# EAGLE design TT7-F v1.4 (EAGLE 7.4.0)
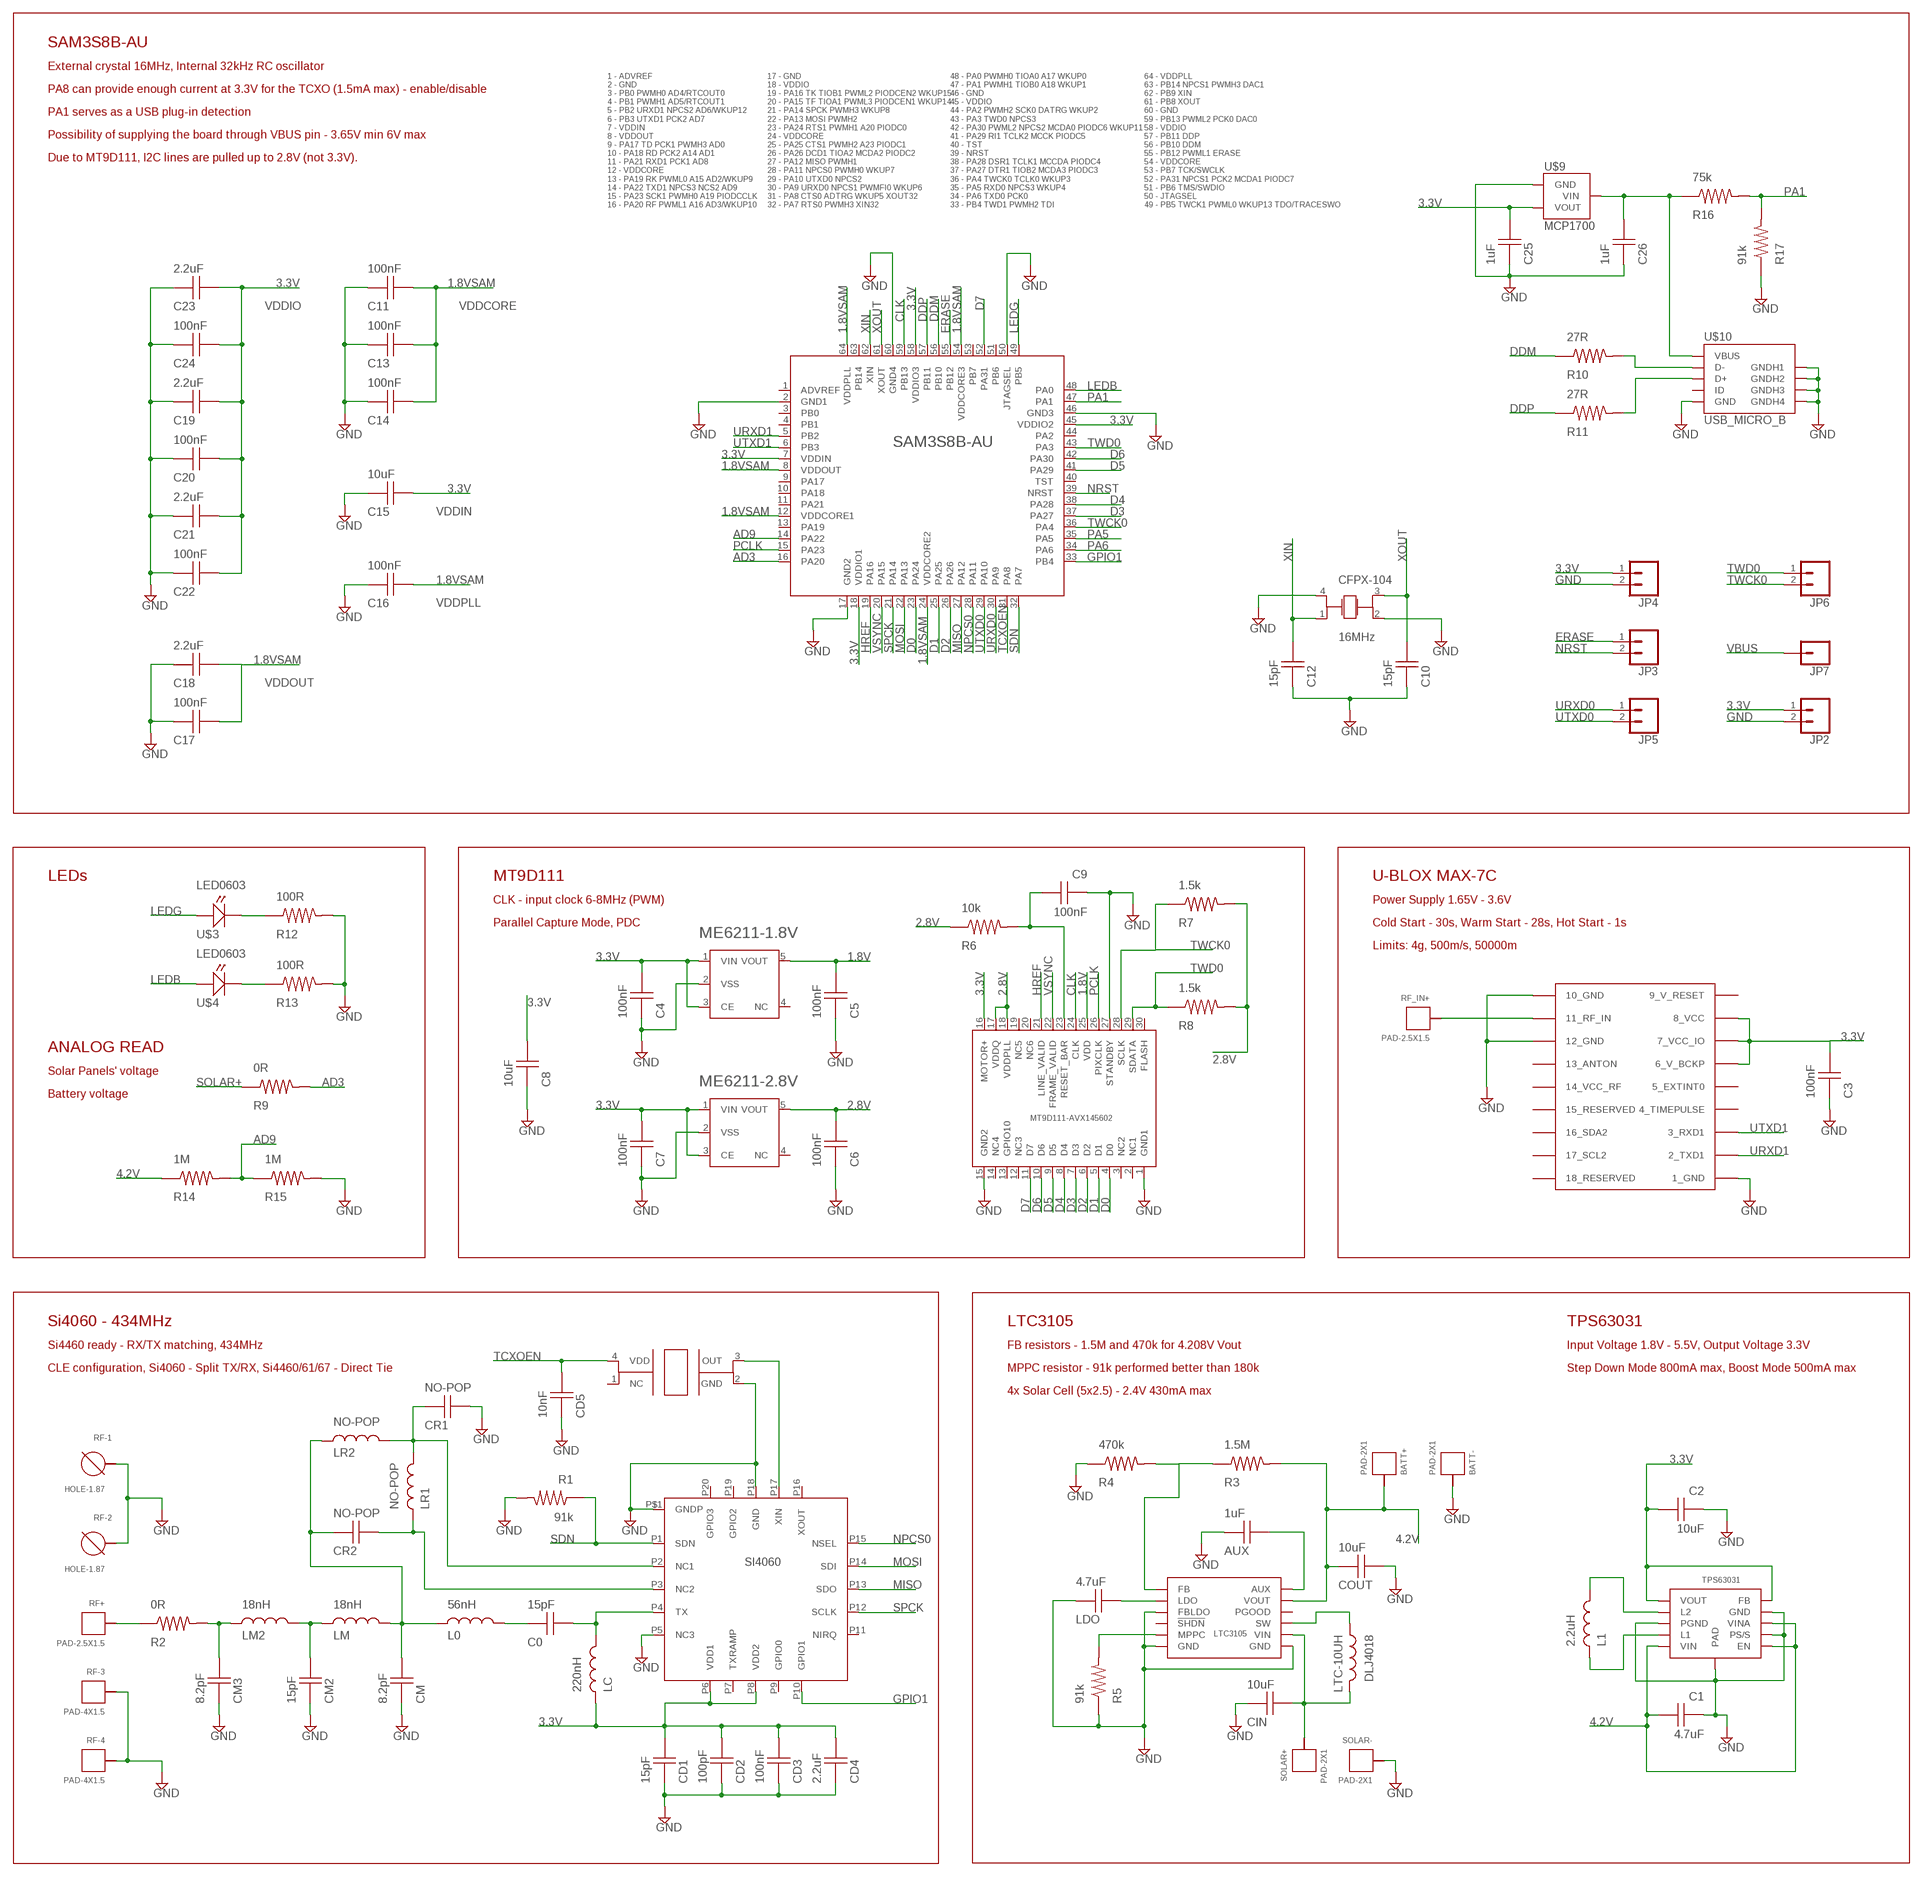
[diagram p0: schematic, sheet 1]

## Parts
AUX  1uF  CAP0603  [CAP0603]
BATT+  PAD-2X1  [PAD-2X1]
BATT-  PAD-2X1  [PAD-2X1]
C0  15pF  CAP0402  [CAP0402]
C1  4.7uF  CAP0603  [CAP0603]
C2  10uF  CAP0805  [CAP0805]
C3  100nF  CAP0402  [CAP0402]
C4  100nF  CAP0402  [CAP0402]
C5  100nF  CAP0402  [CAP0402]
C6  100nF  CAP0402  [CAP0402]
C7  100nF  CAP0402  [CAP0402]
C8  10uF  CAP0805  [CAP0805]
C9  100nF  CAP0402  [CAP0402]
C10  15pF  CAP0402  [CAP0402]
C11  100nF  CAP0402  [CAP0402]
C12  15pF  CAP0402  [CAP0402]
C13  100nF  CAP0402  [CAP0402]
C14  100nF  CAP0402  [CAP0402]
C15  10uF  CAP0603  [CAP0603]
C16  100nF  CAP0402  [CAP0402]
C17  100nF  CAP0402  [CAP0402]
C18  2.2uF  CAP0402  [CAP0402]
C19  2.2uF  CAP0402  [CAP0402]
C20  100nF  CAP0402  [CAP0402]
C21  2.2uF  CAP0402  [CAP0402]
C22  100nF  CAP0402  [CAP0402]
C23  2.2uF  CAP0402  [CAP0402]
C24  100nF  CAP0402  [CAP0402]
C25  1uF  CAP0603  [CAP0603]
C26  1uF  CAP0603  [CAP0603]
CD1  15pF  CAP0402  [CAP0402]
CD2  100pF  CAP0402  [CAP0402]
CD3  100nF  CAP0402  [CAP0402]
CD4  2.2uF  CAP0402  [CAP0402]
CD5  10nF  CAP0402  [CAP0402]
CFPX-104  16MHz  CFPX-104  [CFPX-104]
CIN  10uF  CAP0805  [CAP0805]
CM  8.2pF  CAP0402  [CAP0402]
CM2  15pF  CAP0402  [CAP0402]
CM3  8.2pF  CAP0402  [CAP0402]
COUT  10uF  CAP0805  [CAP0805]
CR1  NO-POP  CAP0402  [CAP0402]
CR2  NO-POP  CAP0402  [CAP0402]
JP2  M021X02_NO_SILK  [1X02_NO_SILK]
JP3  M021X02_NO_SILK  [1X02_NO_SILK]
JP4  M021X02_NO_SILK  [1X02_NO_SILK]
JP5  M021X02_NO_SILK  [1X02_NO_SILK]
JP6  M021X02_NO_SILK  [1X02_NO_SILK]
JP7  M01PTH_NO_SILK_YES_STOP  [1X01_NO_SILK]
L0  56nH  IND0402  [IND0402]
L1  2.2uH  DLJ3015  [DLJ3015]
LC  220nH  IND0402  [IND0402]
LDO  4.7uF  CAP0603  [CAP0603]
LM  18nH  IND0402  [IND0402]
LM2  18nH  IND0402  [IND0402]
LR1  NO-POP  IND0402  [IND0402]
LR2  NO-POP  IND0402  [IND0402]
LTC-10UH  DLJ4018  [DLJ4018]
ME6211-1.8V  ME6211  [ME6211]
ME6211-2.8V  ME6211  [ME6211]
R1  91k  RES0402  [RES0402]
R2  0R  RES0402  [RES0402]
R3  1.5M  RES0402  [RES0402]
R4  470k  RES0402  [RES0402]
R5  91k  RES0402  [RES0402]
R6  10k  RES0402  [RES0402]
R7  1.5k  RES0402  [RES0402]
R8  1.5k  RES0402  [RES0402]
R9  0R  RES0402  [RES0402]
R10  27R  RES0402  [RES0402]
R11  27R  RES0402  [RES0402]
R12  100R  RES0402  [RES0402]
R13  100R  RES0402  [RES0402]
R14  1M  RES0603  [RES0603]
R15  1M  RES0603  [RES0603]
R16  75k  RES0402  [RES0402]
R17  91k  RES0402  [RES0402]
RF+  PAD-2.5X1.5  [PAD-2.5X1.5]
RF-1  HOLE-1.87  [HOLE-1.87]
RF-2  HOLE-1.87  [HOLE-1.87]
RF-3  PAD-4X1.5  [PAD-4X1.5]
RF-4  PAD-4X1.5  [PAD-4X1.5]
RF_IN+  PAD-2.5X1.5  [PAD-2.5X1.5]
SOLAR+  PAD-2X1  [PAD-2X1]
SOLAR-  PAD-2X1  [PAD-2X1]
TCXO  32MHz  I547-2P3_TCXO  [I547-2P3_TCXO]
U1  LTC3105  [LTC3105]
U2  TPS63031  [TPS63031]
U3  MT9D111-AVX145602  [MT9D111-AVX145602]
U4  SAM3S8B-AU  [SAM3S8B-AU]
U$1  SI4060  [SI4060]
U$2  UBLOX_MAX-7C  [UBLOX_MAX-7C]
U$3  LED0603  [LED0603]
U$4  LED0603  [LED0603]
U$9  MCP1700  [MCP1700]
U$10  USB_MICRO_B  [USB_MICRO_B]

## Nets
1.8V: C5.P$2 ME6211-1.8V.5(VOUT) U3.25(VDD)
1.8VSAM: C11.P$2 C13.P$2 C14.P$2 C16.P$2 C17.P$2 C18.P$2 U4.8(VDDOUT) U4.12(VDDCORE1) U4.24(VDDCORE2) U4.54(VDDCORE3) U4.64(VDDPLL)
2.8V: C6.P$2 ME6211-2.8V.5(VOUT) R6.P$1 R7.P$2 R8.P$2 U3.17(VDDQ) U3.18(VDDPLL)
3.3V: C2.P$2 C3.P$2 C4.P$2 C7.P$2 C8.P$2 C15.P$2 C19.P$2 C20.P$2 C21.P$2 C22.P$2 C23.P$2 C24.P$2 C25.P$2 CD1.P$2 CD2.P$2 CD3.P$2 CD4.P$2 JP2.1 JP4.1 LC.P$1 ME6211-1.8V.1(VIN) ME6211-1.8V.3(CE) ME6211-2.8V.1(VIN) ME6211-2.8V.3(CE) U2.1(VOUT) U2.10(FB) U3.16(MOTOR+) U4.7(VDDIN) U4.18(VDDIO1) U4.45(VDDIO2) U4.58(VDDIO3) U$1.P6(VDD1) U$1.P8(VDD2) U$2.6_V_BCKP U$2.7_VCC_IO U$2.8_VCC U$9.2(VOUT)
4.2V: BATT+.P$1 C1.P$2 COUT.P$1 R3.P$2 R14.P$1 U1.11(VOUT) U2.5(VIN) U2.6(EN) U2.8(VINA)
AD3: R9.P$2 U4.16(PA20)
AD9: R14.P$2 R15.P$1 U4.14(PA22)
CLK: U3.24(CLK) U4.59(PB13)
D0: U3.4(D0) U4.23(PA24)
D1: U3.5(D1) U4.25(PA25)
D2: U3.6(D2) U4.26(PA26)
D3: U3.7(D3) U4.37(PA27)
D4: U3.8(D4) U4.38(PA28)
D5: U3.9(D5) U4.41(PA29)
D6: U3.10(D6) U4.42(PA30)
D7: U3.11(D7) U4.52(PA31)
DDM: R10.P$1 U4.56(PB10)
DDP: R11.P$1 U4.57(PB11)
ERASE: JP3.1 U4.55(PB12)
GND: AUX.P$1 BATT-.P$1 C1.P$1 C2.P$1 C3.P$1 C4.P$1 C5.P$1 C6.P$1 C7.P$1 C8.P$1 C9.P$1 C10.P$1 C11.P$1 C12.P$1 C13.P$1 C14.P$1 C15.P$1 C16.P$1 C17.P$1 C18.P$1 C19.P$1 C20.P$1 C21.P$1 C22.P$1 C23.P$1 C24.P$1 C25.P$1 C26.P$1 CD1.P$1 CD2.P$1 CD3.P$1 CD4.P$1 CD5.P$1 CFPX-104.2(GND1) CFPX-104.4(GND2) CIN.P$1 CM2.P$1 CM3.P$1 CM.P$1 COUT.P$2 CR1.P$2 JP2.2 JP4.2 LDO.P$1 ME6211-1.8V.2(VSS) ME6211-2.8V.2(VSS) R1.P$2 R4.P$1 R5.P$1 R12.P$2 R13.P$2 R15.P$2 R17.P$1 RF-1.P$1 RF-2.P$1 RF-3.P$1 RF-4.P$1 SOLAR-.P$1 TCXO.2(GND) U1.3(FBLDO) U1.6(GND) U1.7(GND) U2.3(PGND) U2.7(PS/S) U2.9(GND) U2.11(PAD) U3.1(GND1) U3.15(GND2) U3.27(STANDBY) U4.2(GND1) U4.17(GND2) U4.46(GND3) U4.50(JTAGSEL) U4.60(GND4) U$1.P5(NC3) U$1.P18(GND) U$1.P$1(GNDP) U$2.1_GND U$2.10_GND U$2.12_GND U$9.1(GND) U$10.GND U$10.P$6(GNDH1) U$10.P$7(GNDH2) U$10.P$8(GNDH3) U$10.P$9(GNDH4)
GPIO1: U4.33(PB4) U$1.P10(GPIO1)
HREF: U3.21(LINE_VALID) U4.19(PA16)
LEDB: U4.48(PA0) U$4.ANODE
LEDG: U4.49(PB5) U$3.ANODE
MISO: U4.27(PA12) U$1.P13(SDO)
MOSI: U4.22(PA13) U$1.P14(SDI)
N$1: C0.P$1 L0.P$2
N$2: C0.P$2 LC.P$2 U$1.P4(TX)
N$3: R12.P$1 U$3.CATHODE
N$4: CR1.P$1 LR1.P$2 LR2.P$2 U$1.P2(NC1)
N$5: CR2.P$2 LR1.P$1 U$1.P3(NC2)
N$6: CM.P$2 CR2.P$1 L0.P$1 LM.P$2 LR2.P$1
N$7: CM2.P$2 LM2.P$2 LM.P$1
N$8: CM3.P$2 LM2.P$1 R2.P$2
N$9: TCXO.3(OUT) U$1.P17(XIN)
N$10: L1.P$1 U2.4(L1)
N$11: LTC-10UH.P$1 U1.9(SW)
N$12: R2.P$1 RF+.P$1
N$13: LDO.P$2 U1.2(LDO)
N$14: R5.P$2 U1.5(MPPC)
N$15: AUX.P$2 U1.12(AUX)
N$16: L1.P$2 U2.2(L2)
N$17: R3.P$1 R4.P$2 U1.1(FB)
N$18: RF_IN+.P$1 U$2.11_RF_IN
N$19: R11.P$2 U$10.D+
N$20: R10.P$2 U$10.D-
N$21: C9.P$2 R6.P$2 U3.23(RESET_BAR)
N$25: R13.P$1 U$4.CATHODE
NPCS0: U4.28(PA11) U$1.P15(NSEL)
NRST: JP3.2 U4.39(NRST)
PA1: R16.P$2 R17.P$2 U4.47(PA1)
PA5: U4.35(PA5)
PA6: U4.34(PA6)
PCLK: U3.26(PIXCLK) U4.15(PA23)
SDN: R1.P$1 U4.32(PA7) U$1.P1(SDN)
SOLAR+: CIN.P$2 LTC-10UH.P$2 R9.P$1 SOLAR+.P$1 U1.8(VIN)
SPCK: U4.21(PA14) U$1.P12(SCLK)
TCXOEN: CD5.P$2 TCXO.4(VDD) U4.31(PA8)
TWCK0: JP6.2 R7.P$1 U3.28(SCLK) U4.36(PA4)
TWD0: JP6.1 R8.P$1 U3.29(SDATA) U4.43(PA3)
URXD0: JP5.1 U4.30(PA9)
URXD1: U4.5(PB2) U$2.2_TXD1
UTXD0: JP5.2 U4.29(PA10)
UTXD1: U4.6(PB3) U$2.3_RXD1
VBUS: C26.P$2 JP7.1 R16.P$1 U$9.3(VIN) U$10.VBUS
VSYNC: U3.22(FRAME_VALID) U4.20(PA15)
XIN: C12.P$2 CFPX-104.1(XTAL1) U4.62(XIN)
XOUT: C10.P$2 CFPX-104.3(XTAL2) U4.61(XOUT)
Unconnected: ME6211-1.8V.4(NC) ME6211-2.8V.4(NC) TCXO.1(NC) U1.4(!SHDN) U1.10(PGOOD) U3.2(NC1) U3.3(NC2) U3.12(NC3) U3.13(GPIO10) U3.14(NC4) U3.19(NC5) U3.20(NC6) U3.30(FLASH) U4.1(ADVREF) U4.3(PB0) U4.4(PB1) U4.9(PA17) U4.10(PA18) U4.11(PA21) U4.13(PA19) U4.40(TST) U4.44(PA2) U4.51(PB6) U4.53(PB7) U4.63(PB14) U$1.P7(TXRAMP) U$1.P9(GPIO0) U$1.P11(NIRQ) U$1.P16(XOUT) U$1.P19(GPIO2) U$1.P20(GPIO3) U$2.4_TIMEPULSE U$2.5_EXTINT0 U$2.13_ANTON U$2.14_VCC_RF U$2.15_RESERVED U$2.16_SDA2 U$2.17_SCL2 U$2.18_RESERVED U$10.ID

## Notes on the sheet
- SAM3S8B-AU
- External crystal 16MHz, Internal 32kHz RC oscillator
- PA8 can provide enough current at 3.3V for the TCXO (1.5mA max) - enable/disable
- PA1 serves as a USB plug-in detection
- Possibility of supplying the board through VBUS pin - 3.65V min 6V max
- Due to MT9D111, I2C lines are pulled up to 2.8V (not 3.3V).
- VDDIO | VDDCORE
- VDDIN
- VDDPLL
- VDDOUT
- LEDs | MT9D111 | U-BLOX MAX-7C
- CLK - input clock 6-8MHz (PWM) | Power Supply 1.65V - 3.6V
- Parallel Capture Mode, PDC | Cold Start - 30s, Warm Start - 28s, Hot Start - 1s
- Limits: 4g, 500m/s, 50000m
- ANALOG READ
- Solar Panels' voltage
- Battery voltage
- Si4060 - 434MHz | LTC3105 | TPS63031
- Si4460 ready - RX/TX matching, 434MHz | FB resistors - 1.5M and 470k for 4.208V Vout | Input Voltage 1.8V - 5.5V, Output Voltage 3.3V
- CLE configuration, Si4060 - Split TX/RX, Si4460/61/67 - Direct Tie | MPPC resistor - 91k performed better than 180k | Step Down Mode 800mA max, Boost Mode 500mA max
- 4x Solar Cell (5x2.5) - 2.4V 430mA max

## Power pins joined to a net without a drawn wire
9_V_RESET: U$2.9_V_RESET

## Library data of the parts
AUX C1 C15 C25 C26 LDO = TT7:CAP0603: CAPACITOR 0603 - 1.55 x 0.85 x 0.45mm
BATT+ BATT- SOLAR+ SOLAR- = TT7:PAD-2X1: Pad - 2 x 1 mm
C0 C3-C7 C9-C14 C16-C24 CD1-CD5 CM CM2 CM3 CR1 CR2 = TT7:CAP0402: CAPACITOR 0402 - 1 x 0.5 x 0.35mm
C2 C8 CIN COUT = TT7:CAP0805: CAPACITOR 0805 - 2.0 x 1.2 x 0.45mm
CFPX-104 = TT7:CFPX-104: CFPX-104 Crystal Oscillator
JP2-JP6 = SparkFun-Connectors:M02: Standard 2-pin 0.1" header. Use with - straight break away headers ( PRT-00116) - right angle break away headers (PRT-00553) - swiss pins (PRT-00743) - machine pins (PRT-00117) - female headers (PRT-00115) Molex polarized connector foot print use with: PRT-08233 with associated crimp pins and housings. 2.54_SCREWTERM for use with PRT-10571. 3.5mm Screw Terminal footprints for PRT-08084 5mm Screw Terminal footprints for use with PRT-08432
JP7 = SparkFun-Connectors:M01: Header 1 Standard 1-pin 0.1" header. Use with straight break away headers (SKU : PRT-00116), right angle break away headers (PRT-00553), swiss pins (PRT-00743), machine pins (PRT-00117), and female headers (PRT-00115). SMTSO-256-ET is a "flush mount" nut for a 4-40 screw. The older package used to be too tight, and did not allow it to sit properly thru the drill hit. The latest (0.165DIA) fits nice and snug.
L0 LC LM LM2 LR1 LR2 = TT7:IND0402: INDUCTOR 0402 - 1 x 0.5 x 0.35mm
L1 = TT7:DLJ3015: FERROCORE DLJ3015-2.2
LTC-10UH = TT7:DLJ4018: FERROCORE DLJ4018-10uH
ME6211-1.8V ME6211-2.8V = TT7:ME6211: ME6211-1.8 and ME6211-2.8 in SOT23-5 package
R1-R13 R16 R17 = TT7:RES0402: RESISTOR 0402 - 1 x 0.5 x 0.35mm
R14 R15 = TT7:RES0603: RESISTOR 0603 - 1.55 x 0.85 x 0.45mm
RF+ RF_IN+ = TT7:PAD-2.5X1.5: Pad - 2.5 x 1.5 mm
RF-1 RF-2 = TT7:HOLE-1.87: Hole - 1.016/1.87mm
RF-3 RF-4 = TT7:PAD-4X1.5: Pad - 4 x 1.5 mm
TCXO = TT7:I547-2P3_TCXO: I547-2P3-32.0000M TCXO
U1 = TT7:LTC3105: LTC3105 MSOP-12
U2 = TT7:TPS63031: TPS63031
U3 = TT7:MT9D111-AVX145602: MT9D111 - AVX145602‐030000‐829 connector
U4 = TT7:SAM3S8B-AU: SAM3S8B-AU
U$1 = TT7:SI4060: SI4060
U$2 = TT7:UBLOX_MAX-7C: UBLOX MAX
U$3 U$4 = TT7:LED0603: LED 0603
U$9 = TT7:MCP1700: MCP1700 - SOT-23 package
U$10 = TT7:USB_MICRO_B: USB Micro-B connector

## Board
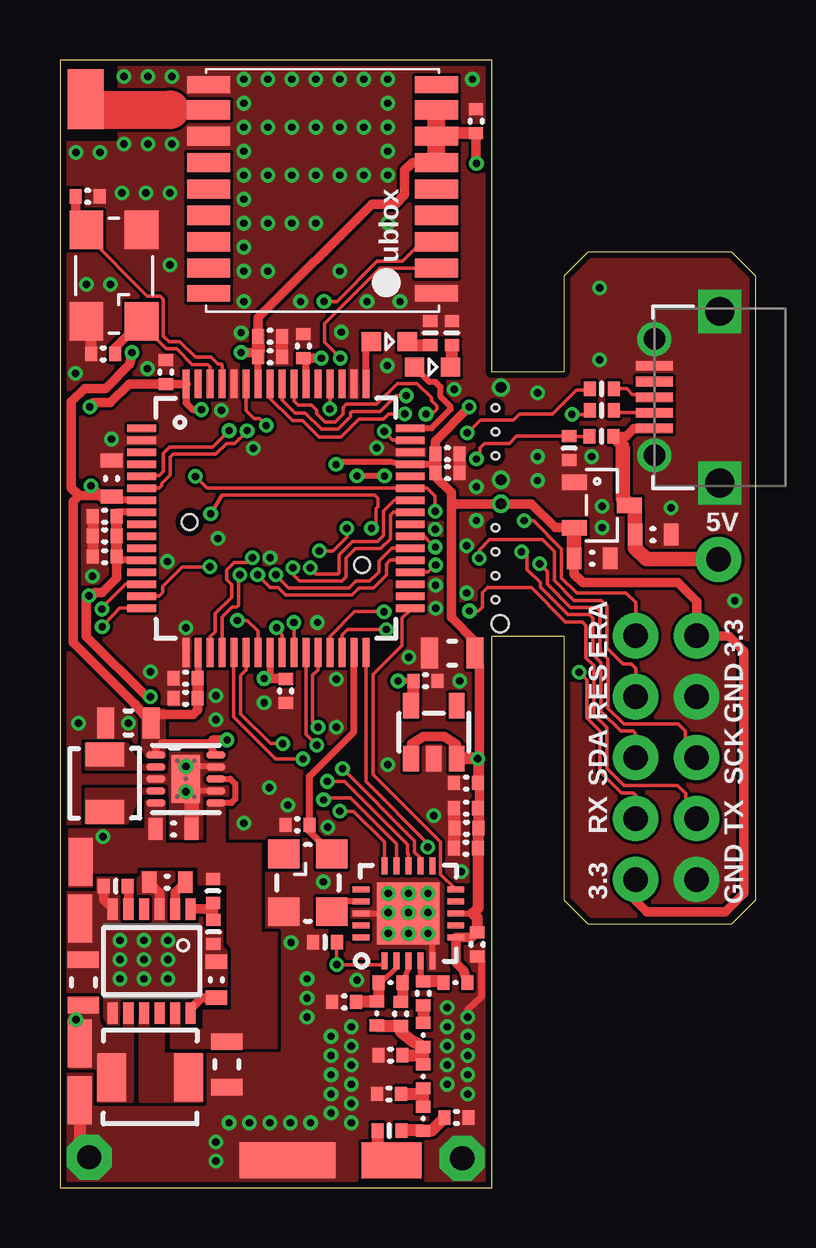
[diagram p1: board, top side]
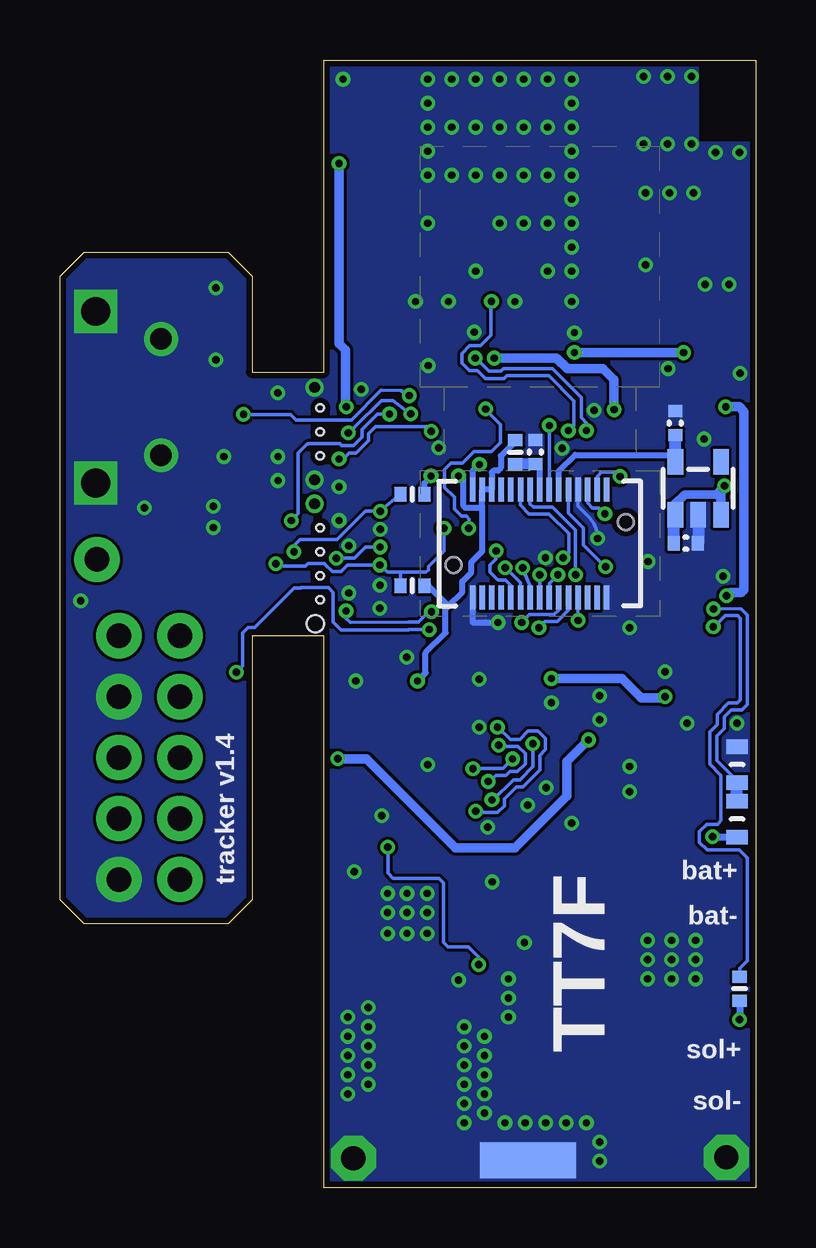
[diagram p2: board, bottom side, seen from below]

Size 29 x 47 mm. Coordinates in mm from the lower left corner, seen from the top.
Outline: 0,0 18,0 18,23 21,23 21,12 22,11 28,11 29,12 29,38 28,39 22,39 21,38 21,34 18,34 18,47 0,47 0,0
Copper layers (1*16): Top 0.035mm / dielectric 1.5mm / Bottom 0.035mm
Design rules "dirt_cheap_dirty_boards.v1": minimum track width 5mil, minimum drill 12mil, track to track 5mil, track to pad 5mil, pad to pad 5mil, via to via 5mil, smd to smd 0mil, copper to edge 10mil, drill to drill 10mil, minimum pad ring 10mil, minimum via ring 6mil, stop-mask expansion 2mil, vias tented up to drill 25mil, thermal gap 10mil
Holes 0.31 mm at 18.15,25.5 18.15,26.5 18.15,24.5 18.15,30.5 18.15,31.5 18.15,32.5 18.15,27.5
Holes 0.7 mm at 18.35,23.5
Holes 0.65 mm at 12.6,25.94 5.4,27.74

### Footprints (pad centres in the part's own frame; a part is rotated, then mirrored left to right if it is on the bottom)
CAP0603 = smd 0.6 x 0.9: P$1 -0.75,0; P$2 0.75,0
PAD-2X1 = smd 2 x 1: P$1 0,0
CAP0402 = smd 0.5 x 0.6: P$1 -0.5,0; P$2 0.5,0
CAP0805 = smd 0.7 x 1.3: P$1 -0.95,0; P$2 0.95,0
CFPX-104 = smd 1.6 x 1.4: 1 -1.9,-1.15; 2 1.9,-1.15; 3 1.9,1.15; 4 -1.9,1.15
1X02_NO_SILK = drill 1.016 pad 1.88: 1 0,0; 2 2.54,0
1X01_NO_SILK = drill 1.016 pad 1.88: 1 0,0
IND0402 = smd 0.5 x 0.6: P$1 -0.5,0; P$2 0.5,0
DLJ3015 = smd 1 x 1.6: P$1 -1.2,0; P$2 1.2,0
DLJ4018 = smd 1.2 x 2: P$1 -1.6,0; P$2 1.6,0
ME6211 = smd 0.65 x 1.06: 1 -0.95,-1.1; 2 0,-1.1; 3 0.95,-1.1; 4 0.95,1.1; 5 -0.95,1.1
RES0402 = smd 0.5 x 0.6: P$1 -0.5,0; P$2 0.5,0
RES0603 = smd 0.6 x 0.9: P$1 -0.75,0; P$2 0.75,0
PAD-2.5X1.5 = smd 2.5 x 1.5: P$1 0,0
HOLE-1.87 = drill 1.016 pad 1.87 octagon: P$1 0,0
PAD-4X1.5 = smd 4 x 1.5: P$1 0,0
I547-2P3_TCXO = smd 1.2 x 1.3: 1 -1.2,-1; 2 1.2,-1; 3 1.2,1; 4 -1.2,1
LTC3105 = smd 0.42 x 0.9: 1 -1.625,-2.165; 2 -0.975,-2.165; 3 -0.325,-2.165; 4 0.325,-2.165; 5 0.975,-2.165; 6 1.625,-2.165; 7 1.625,2.165; 8 0.975,2.165; 9 0.325,2.165; 10 -0.325,2.165; 11 -0.975,2.165; 12 -1.625,2.165
TPS63031 = smd 0.8 x 0.28: 1 -1.25,1; 2 -1.25,0.5; 3 -1.25,0; 4 -1.25,-0.5; 5 -1.25,-1; 6 1.25,-1; 7 1.25,-0.5; 8 1.25,0; 9 1.25,0.5; 10 1.25,1 | smd 1.2 x 2: 11 0,0
MT9D111-AVX145602 = smd 0.23 x 1: 1 2.8,-2.25; 2 2.4,-2.25; 3 2,-2.25; 4 1.6,-2.25; 5 1.2,-2.25; 6 0.8,-2.25; 7 0.4,-2.25; 8 0,-2.25; 9 -0.4,-2.25; 10 -0.8,-2.25; 11 -1.2,-2.25; 12 -1.6,-2.25; 13 -2,-2.25; 14 -2.4,-2.25; 15 -2.8,-2.25; 16 -2.8,2.25; 17 -2.4,2.25; 18 -2,2.25; 19 -1.6,2.25; 20 -1.2,2.25; 21 -0.8,2.25; 22 -0.4,2.25; 23 0,2.25; 24 0.4,2.25; 25 0.8,2.25; 26 1.2,2.25; 27 1.6,2.25; 28 2,2.25; 29 2.4,2.25; 30 2.8,2.25
SAM3S8B-AU = smd 1.2 x 0.3: 1 -5.6,3.75; 2 -5.6,3.25; 3 -5.6,2.75; 4 -5.6,2.25; 5 -5.6,1.75; 6 -5.6,1.25; 7 -5.6,0.75; 8 -5.6,0.25; 9 -5.6,-0.25; 10 -5.6,-0.75; 11 -5.6,-1.25; 12 -5.6,-1.75; 13 -5.6,-2.25; 14 -5.6,-2.75; 15 -5.6,-3.25; 16 -5.6,-3.75; 33 5.6,-3.75; 34 5.6,-3.25; 35 5.6,-2.75; 36 5.6,-2.25; 37 5.6,-1.75; 38 5.6,-1.25; 39 5.6,-0.75; 40 5.6,-0.25; 41 5.6,0.25; 42 5.6,0.75; 43 5.6,1.25; 44 5.6,1.75; 45 5.6,2.25; 46 5.6,2.75; 47 5.6,3.25; 48 5.6,3.75 | smd 0.3 x 1.2: 17 -3.75,-5.6; 18 -3.25,-5.6; 19 -2.75,-5.6; 20 -2.25,-5.6; 21 -1.75,-5.6; 22 -1.25,-5.6; 23 -0.75,-5.6; 24 -0.25,-5.6; 25 0.25,-5.6; 26 0.75,-5.6; 27 1.25,-5.6; 28 1.75,-5.6; 29 2.25,-5.6; 30 2.75,-5.6; 31 3.25,-5.6; 32 3.75,-5.6; 49 3.75,5.6; 50 3.25,5.6; 51 2.75,5.6; 52 2.25,5.6; 53 1.75,5.6; 54 1.25,5.6; 55 0.75,5.6; 56 0.25,5.6; 57 -0.25,5.6; 58 -0.75,5.6; 59 -1.25,5.6; 60 -1.75,5.6; 61 -2.25,5.6; 62 -2.75,5.6; 63 -3.25,5.6; 64 -3.75,5.6
SI4060 = smd 0.7 x 0.25: P1 -1.975,1; P2 -1.975,0.5; P3 -1.975,0; P4 -1.975,-0.5; P5 -1.975,-1; P11 1.975,-1; P12 1.975,-0.5; P13 1.975,0; P14 1.975,0.5; P15 1.975,1 | smd 0.25 x 0.7: P6 -1,-1.975; P7 -0.5,-1.975; P8 0,-1.975; P9 0.5,-1.975; P10 1,-1.975; P16 1,1.975; P17 0.5,1.975; P18 0,1.975; P19 -0.5,1.975; P20 -1,1.975 | smd 2.6 x 2.6: P$1 0,0
UBLOX_MAX-7C = smd 1.8 x 0.7: 1_GND 4.95,-4.4; 9_V_RESET 4.95,4.3; 10_GND -4.55,4.3; 18_RESERVED -4.55,-4.4 | smd 1.8 x 0.8: 2_TXD1 4.95,-3.35; 3_RXD1 4.95,-2.25; 4_TIMEPULSE 4.95,-1.15; 5_EXTINT0 4.95,-0.05; 6_V_BCKP 4.95,1.05; 7_VCC_IO 4.95,2.15; 8_VCC 4.95,3.25; 11_RF_IN -4.55,3.25; 12_GND -4.55,2.15; 13_ANTON -4.55,1.05; 14_VCC_RF -4.55,-0.05; 15_RESERVED -4.55,-1.15; 16_SDA2 -4.55,-2.25; 17_SCL2 -4.55,-3.35
LED0603 = smd 0.8 x 0.8: ANODE -0.75,0; CATHODE 0.75,0
MCP1700 = smd 0.65 x 1.05: 1 -0.95,-1.15; 2 0.95,-1.15; 3 0,1.15
USB_MICRO_B = smd 0.4 x 1.55: D+ 0,2.73; D- -0.65,2.73; GND 1.3,2.73; ID 0.65,2.73; VBUS -1.3,2.73 | drill 1.2 pad 1.8 square: P$6 -3.575,0; P$7 3.575,0 | drill 0.9: P$8 -2.425,2.73; P$9 2.425,2.73

### Placement (x,y rotation side)
AUX  6.51,8.66 270 top
BATT+  0.87,13.57 90 top
BATT-  0.85,11.22 270 top
C0  15.15,8.09 90 top
C1  4.74,14.95 180 top
C2  2.86,19.37 0 top
C3  17.34,44.45 270 top
C4  2.91,26.86 180 bottom
C5  3.35,31.86 270 bottom
C6  15.24,21.11 180 top
C7  16.94,16.86 0 top
C8  16.36,22.28 0 top
C9  9.18,30.66 270 bottom
C10  1.15,41.32 180 top
C11  9.41,20.69 90 top
C12  1.8,34.75 0 top
C13  10.15,35.07 270 top
C14  4.41,33.99 270 top
C15  2.15,29.55 270 top
C16  1.87,27.17 0 top
C17  1.86,26.3 0 top
C18  1.86,27.99 0 top
C19  5.24,21.23 0 top
C20  5.24,20.39 0 top
C21  16.15,29.8 180 top
C22  8.77,35.48 180 top
C23  8.76,34.63 180 top
C24  16.15,30.59 180 top
C25  22.19,26.23 180 top
C26  24.72,27.22 180 top
CD1  17.39,10.13 90 top
CD2  16.93,14.14 0 top
CD3  16.94,14.98 0 top
CD4  16.94,15.82 0 top
CD5  9.9,15.11 0 top
CFPX-104  2.26,38.01 90 top
CIN  0.97,8.55 270 top
CM  13.78,5.51 0 top
CM2  13.73,3.91 0 top
CM3  16.53,2.91 180 top
COUT  6.96,5.14 270 top
CR1  11.85,7.74 180 top
CR2  14.2,7.24 90 top
JP2  24,12.84 0 top
JP3  24,23 270 top
JP4  26.54,23 270 top
JP5  24,15.38 0 top
JP6  24,17.92 0 top
JP7  27.46,26.18 0 top
L0  15.15,6.36 90 top
L1  1.88,16.85 90 top
LC  16.49,8.55 180 top
LDO  4.47,12.72 0 top
LM  15.14,4.63 90 top
LM2  15.14,2.87 90 top
LR1  13.78,8.54 180 top
LR2  13.21,7.26 90 top
LTC-10UH  3.76,4.6 180 top
ME6211-1.8V  2.4,29.15 0 bottom
ME6211-2.8V  15.59,18.98 0 top
R1  11.04,10.22 180 top
R2  13.74,2.38 0 top
R3  6.38,12.35 90 top
R4  6.4,10.65 90 top
R5  2.33,12.57 0 top
R6  10.01,30.65 270 bottom
R7  14.31,25.08 0 bottom
R8  14.31,28.9 0 bottom
R9  0.66,8.28 90 bottom
R10  22.59,32.4 0 top
R11  22.59,33.3 0 top
R12  15.44,35.62 90 top
R13  16.34,35.62 90 top
R14  0.77,15.36 90 bottom
R15  0.77,17.63 90 bottom
R16  22.57,31.31 180 top
R17  21.23,30.81 90 top
RF+  13.82,1.13 0 top
RF-1  16.77,1.22 0 top
RF-2  1.22,1.26 0 top
RF-3  9.49,1.13 0 top
RF-4  9.48,1.14 0 bottom
RF_IN+  1.08,45.37 90 top
SOLAR+  0.82,6 270 top
SOLAR-  0.81,3.63 270 top
TCXO  10.33,12.7 270 top
U1  3.83,9.44 180 top
U2  5.25,17.03 0 top
U3  9,26.84 0 bottom
U4  9.01,27.9 0 top
U$1  14.53,11.43 90 top
U$2  10.75,41.67 0 top
U$3  13.73,35.26 0 top
U$4  15.53,34.2 0 top
U$9  22.6,28.45 270 top
U$10  27.51,32.94 90 top

### Tracks (layer width: path | path; a pad name or v marks a point on that pad's centre or on a via)
1.8V
  Bottom 0.25: U3.25 8.2,29.86 7.52,30.54 3.64,30.54 ME6211-1.8V.5
  Bottom 0.4: C5.P$2
  Bottom 0.5: ME6211-1.8V.5 C5.P$2
1.8VSAM  (via drill 0.3)
  Top 0.15: C17.P$2 | C16.P$2 | 2.36,28.15 C18.P$2 | C11.P$2 arc90 9.38,21.22 | 8.76,21.22 v8.51,21.22 | 10.26,34.47 arc90 C13.P$2 | v5.89,32.43 v5.9,32.43
  Top 0.3: U4.12 2.36,26.15 | U4.8 2.36,28.15 | U4.24 8.76,21.22 | U4.54 10.26,34.47 | U4.64 5.25,32.7 5.52,32.43 v5.89,32.43
  Top 0.35: C14.P$2 5.25,33.49
  Top 0.4: 9.38,21.22 v8.51,21.22 | v3.77,20.46 3.69,20.38 1.1,22.97 1.1,24.55 1.3,24.62 | 1.3,24.62 1.45,24.8 1.76,24.8 2.36,25.4 2.36,26.15 C17.P$2 | 5.25,33.49 U4.64 | C14.P$2 2.88,33.49 2.1,32.71 1.41,32.71 v1.24,32.54 | v1.21,24.66 1.15,24.72 1.3,24.62 | v10.9,34.58 C13.P$2
  Top 0.45: C17.P$2 C16.P$2 | C16.P$2 C18.P$2
  Bottom 0.4: v8.51,21.22 5.57,21.22 4.76,20.41 3.89,20.41 v3.77,20.46 | v1.24,32.54 0.69,32.54 0.49,32.34 0.49,24.91 0.6,24.79 1.05,24.79 v1.21,24.66 | v5.9,32.43 5.9,33.67 6.36,34.13 7.84,34.13 8.29,34.58 v10.9,34.58
2.8V  (via drill 0.3)
  Top 0.15: v12.39,29.66
  Top 0.25: C6.P$2 v14.09,21.11 | v14.09,21.11 | v13.53,29.66 v12.39,29.66
  Top 0.4: ME6211-2.8V.5 14.73,20.18
  Top 0.5: 14.73,20.18 C6.P$2
  Bottom 0.25: v14.09,21.11 v14.08,21.11 13.75,21.45 13.75,22.3 12.92,23.12 12.92,24.11 12.79,24.24 | 12.79,24.24 12.23,24.8 12.23,25.27 11.85,25.64 11.85,26.07 11.39,26.52 11.39,28.34 | 11.39,28.34 11.39,28.41 11.4,28.41 U3.17 U3.18 10.99,29.81 10.92,29.88 10.73,29.88 10.62,30 10.62,30.49 10.01,31.09 R6.P$1 | R7.P$2 13.63,25.08 12.79,24.24 | R8.P$2 13.81,29.36 v13.53,29.66 | v12.39,29.66 12.3,29.65 12.19,29.55 12.19,28.43 12.1,28.34 11.39,28.34
3.3V  (via drill 0.3, 0.45)
  Top 0.15: 5.75,21.24 arc-90 C19.P$2 | 4.17,19.73 C2.P$2 | 2.15,28.65 C15.P$2 | U4.7 1.72,28.79 1.84,28.84 | U4.58 | C23.P$2 | 15.83,43.95 U$2.7_VCC_IO | C21.P$2
  Top 0.25: C8.P$2 17.31,21.96 17.48,21.78 | U4.45 14.12,30.15 13.82,30.24 11.61,30.24 v11.51,30.14
  Top 0.26: U$1.P8 17.21,11.44
  Top 0.3: CD4.P$2 | CD3.P$2 | U2.10 6.22,18.49 | 4.26,18.49 arc90 U2.1 | U4.18 5.75,21.24 | U4.7 2.15,28.65 | U4.58 C23.P$2 | U4.45 15.65,30.15
  Top 0.4: CD1.P$2 17.19,10.43 U$1.P6 16.5,9.37 16.82,9.05 LC.P$1 | 4.26,18.49 6.22,18.49 6.39,18.66 v6.96,18.66 | C20.P$2 5.74,19.91 5.55,19.73 4.17,19.73 | 1.84,28.84 0.8,28.84 | 0.8,28.84 0.55,28.59 0.55,22.71 3.09,20.17 C2.P$2 | 8.27,34.8 v7.55,34.8 | v3,34.8 2.9,34.32 1.91,33.31 1.04,33.31 0.48,32.75 0.48,29.16 0.8,28.84 | C22.P$2 8.27,36.27 13,41 14,41 14.37,41.38 14.37,42.4 14.7,42.73 U$2.6_V_BCKP | C21.P$2 15.65,31.12 v17.06,32.53 v17.06,32.54 | v17.36,42.69 17.34,42.7 C3.P$2 | CD4.P$2 17.48,15.86 17.48,16.82 | 17.48,16.82 17.48,21.78 | 17.48,16.82 C7.P$2 17.44,17.88 | ME6211-2.8V.3 16.54,18.46 16,18.8 15.15,18.8 14.65,18.5 ME6211-2.8V.1 | 1.72,28.79 v1.29,29.25 | C8.P$2 17.31,22.76 16.32,23.75 16.32,28.51 | 16.32,28.51 16.32,28.96 15.65,29.62 C21.P$2 | 16.32,28.51 16.33,28.5 v18.38,28.5 19.67,28.5 20.66,27.5 U$9.2 21.44,27.48 | C25.P$2 21.44,25.57 21.79,25.21 25.75,25.21 26.54,24.43 JP4.1 27.88,23 28.5,22.37 28.5,12.26 27.74,11.49 24.46,11.49 24,11.95 JP2.1
  Top 0.45: CD4.P$2 CD3.P$2 | CD3.P$2 CD2.P$2 17.43,11.65 17.21,11.44 17.39,11.26 CD1.P$2 | C19.P$2 C20.P$2
  Top 0.5: C23.P$2 C22.P$2 8.27,34.8 | C3.P$2 15.83,43.95 | C21.P$2 C24.P$2 | 15.65,30.15 C21.P$2 | 17.44,17.88 ME6211-2.8V.3
  Top 0.6: C25.P$2 21.44,27.48
  Top 0.75: U$2.6_V_BCKP U$2.7_VCC_IO U$2.8_VCC
  Bottom 0.15: v11.51,30.14 11.53,30.14 | U3.16
  Bottom 0.25: 11.53,30.14 11.8,29.87 U3.16
  Bottom 0.35: 3.35,28.52 2.95,28.89 1.63,28.89
  Bottom 0.4: v7.55,34.8 v3,34.8 | v17.06,32.54 17.09,32.57 17.09,34.91 17.36,35.18 v17.36,42.69 | 3.35,28.52 ME6211-1.8V.1 3.41,27.98 | 1.63,28.89 v1.29,29.25 1.45,29.09 ME6211-1.8V.3 | v17.42,17.87 16.21,17.87 16.21,17.86 12.51,14.16 10.03,14.16 7.87,16.33 7.87,17.76 v6.96,18.66
  Bottom 0.5: C4.P$2 3.41,27.98
  pour Top (no thermals): 3.65,17.95 4.35,17.95 4.35,19.9 3.45,19.9 3.45,18.3
4.2V  (via drill 0.3)
  Top 0.15: U2.6
  Top 0.25: U2.8 7.1,17.03 7.3,16.83 7.3,16.19 7.14,16.02 U2.6
  Bottom 0.15: 0.78,14.62 R14.P$1
  Bottom 0.3: v1.8,14.62 0.78,14.62
  pour Top (no thermals): 4.65,7 4.95,7 4.95,6.55 6,6.55 6,7.35 9,7.35 9,5.85 4.65,5.85
  pour Top (no thermals): 9,7 9,10.6 8.35,10.6 8.35,14.3 4.35,14.3 4.35,16.1 3.6,16.1 3.6,14.9 0.4,14.9 0.4,12.55 1.3,12.55 1.3,13.15 3.15,13.15 3.15,13.4 5.8,13.4 5.8,12.65 7,12.65 7,10.2 7.2,10 7.2,7
  pour Top (no thermals): 6.17,14 6.17,16.1 6.85,16.1 6.85,14
AD3  (via drill 0.3)
  Top 0.15: v1.76,23.37 1.85,23.46 2.49,24.15 U4.16
  Bottom 0.15: R9.P$2 0.66,9.13 0.34,9.45 0.34,13.74 0.67,14.07 2.01,14.07 2.33,14.39 2.33,14.84 2.03,15.14 1.58,15.14 1.44,15.29 1.44,17.18 1.91,17.65 1.91,18.99 1.6,19.31 1.6,19.73 1.13,20.19 0.76,20.19 0.64,20.32 0.64,23.72 0.75,23.84 1.26,23.84 1.72,23.37 v1.76,23.37
AD9  (via drill 0.3)
  Top 0.15: v1.75,24.11 1.83,24.24 1.83,24.25 2.73,25.15 U4.14
  Bottom 0.15: R15.P$1 0.77,16.97 1.62,17.81 1.62,18.83 1.3,19.14 1.3,19.61 1.01,19.91 0.57,19.91 0.35,20.13 0.35,23.87 0.6,24.12 1.7,24.12 v1.75,24.11
  Bottom 0.5: R14.P$2 R15.P$1
CLK  (via drill 0.3)
  Top 0.15: U4.59 7.75,32.38 8.1,32.04 8.32,32.04 v8.6,31.76
  Bottom 0.15: U3.24 v8.6,31.76
D0  (via drill 0.3)
  Top 0.15: U4.23 8.26,23.19 7.81,23.64 7.42,23.64 v7.4,23.64
  Bottom 0.15: U3.4 v7.4,23.64
D1  (via drill 0.3)
  Top 0.15: U4.25 9.26,23.04 v9.03,23.34
  Bottom 0.15: v9.03,23.34 8.77,23.6 8.27,23.6 7.8,24.07 U3.5
D2  (via drill 0.3)
  Top 0.15: U4.26 9.76,23.26 v9.75,23.55
  Bottom 0.15: U3.6 8.2,24.08 8.4,23.88 9.42,23.88 v9.75,23.55
D3  (via drill 0.3)
  Top 0.15: U4.37 13.77,26.15 13.62,25.99 13.62,25.54 13.07,25 13.07,24.98 12.48,24.98 12.18,24.69 9.41,24.69 9.08,25.02 8.76,25.01 8.49,25.28 v8.24,25.54
  Bottom 0.15: v8.24,25.54 8.24,25.53 8.6,25.17 U3.7
D4  (via drill 0.3)
  Top 0.15: U4.38 13.84,26.65 13.31,26.11 13.31,25.73 13.31,25.67 13.27,25.62 12.91,25.27 12.35,25.27 12.05,24.98 9.53,24.98 v8.99,25.54
  Bottom 0.15: v8.99,25.54 U3.8
D5  (via drill 0.3)
  Top 0.15: U4.41 13.9,28.15 13.78,28.03 13.78,27.04 13.38,26.63 12.32,26.63 11.92,26.23 11.92,25.44 11.76,25.28 9.99,25.28 9.7,25.57 v9.7,25.83
  Bottom 0.15: v9.7,25.83 9.63,25.64 9.66,25.71 9.7,25.8 9.54,25.43 9.4,25.09 9.4,25.08 U3.9
D6  (via drill 0.3)
  Top 0.15: U4.42 13.96,28.65 13.5,28.19 13.5,27.18 13.24,26.92 12.19,26.92 11.63,26.36 11.63,25.61 11.59,25.57 10.65,25.57 v10.44,25.83
  Bottom 0.15: v10.44,25.83 10.41,25.82 9.81,25.22 U3.10
D7  (via drill 0.3)
  Top 0.15: U4.52 v11.26,32.45 | v11.96,27.48 11.96,27.3 11.96,27.11 11.39,26.53 v10.82,26.53
  Bottom 0.15: v11.26,32.45 11.28,32.45 11.26,32.43 10.63,31.8 10.63,31.05 11.02,30.67 11.75,30.67 12.22,30.19 12.7,30.19 12.96,29.93 12.96,29.19 12.55,28.77 12.55,28.28 12.25,27.98 12.05,27.98 11.95,27.87 11.94,27.52 11.95,27.5 v11.96,27.48 | v10.82,26.53 10.82,26.2 11.07,25.94 11.07,25.66 10.74,25.32 10.42,25.32 10.2,25.1 U3.11
DDM  (via drill 0.3)
  Top 0.15: U4.56 9.26,32.83 9.8,32.29 10.22,32.29 10.9,31.61 11.59,31.61 12.12,32.13 12.12,32.3 12.17,32.35 13.34,32.35 14.01,33.01 v14.44,33.01 | R10.P$1 22.09,32.23 v21.35,32.23
  Bottom 0.15: v14.44,33.01 14.47,33.01 14.61,33.11 14.79,33.23 15.61,33.23 16.84,31.99 19.15,31.99 19.39,32.23 v21.35,32.23
DDP  (via drill 0.3)
  Top 0.15: U4.57 8.76,32.89 9.69,31.96 10.12,31.96 10.79,31.28 11.72,31.28 12.47,32.04 13.48,32.04 13.69,32.25 v14.38,32.25 | v16.98,31.46 17.17,31.64 17.52,32 18.91,32 19.15,32.23 20.52,32.23 21.54,33.24 22.09,33.24 R11.P$1
  Bottom 0.15: v14.38,32.25 15.1,32.8 15.58,32.8 16.75,31.68 v16.98,31.46
ERASE  (via drill 0.3)
  Top 0.15: U4.55 9.76,32.79 9.93,32.61 10.49,32.61 10.7,32.4 10.7,32.25 11.04,31.91 11.47,31.91 11.8,32.24 11.8,32.52 11.93,32.65 13.2,32.65 14.08,33.52 14.89,33.52 15.49,32.92 15.49,32.8 15.72,32.58 15.72,32.45 15.52,32.24 v15.26,32.24 | v19.36,27.8 19.73,27.8 20.91,26.62 20.91,25.41 21.54,24.79 23.6,24.79 24.01,24.38 24.01,24.06 24,24.05 JP3.1
  Bottom 0.15: v15.26,32.24 15.76,32.24 16.41,31.58 16.41,31.28 16.74,30.96 16.76,30.93 17.25,30.93 17.32,31 18.64,31 18.65,30.99 18.7,30.99 19.06,30.62 19.06,28.09 v19.36,27.8
GND  (via drill 0.3, 0.45)
  Top 0.15: CD2.P$1 16.44,14.15 | 5.28,16.53 v5.25,16.5 arc-90 5.49,16.26 | 1.3,35.92 CFPX-104.4 | C16.P$1 1.36,27.16 | C23.P$1 | CD4.P$1 | U2.9 6.48,17.55 | 16.65,29.82 16.68,29.8
  Top 0.2: 15.53,10.42 v15.34,10.59
  Top 0.25: U$1.P18 U$1.P$1 | U$1.P5 15.53,10.42 | U2.7 5.28,16.53 | 6.48,17.55 v5.25,17.55
  Top 0.3: CD1.P$1 17.57,9.5 17.57,7.94 17,7.42 v17,7.1
  Top 0.4: U1.3 4.16,12.29 LDO.P$1 | U1.6 1.83,11.98 R5.P$1
  Top 0.45: C12.P$1 1.3,35.92 | C18.P$1 C16.P$1 | 1.36,27.16 C17.P$1
  Top 0.5: 16.44,14.15 CD3.P$1 CD4.P$1 | C23.P$1 C22.P$1 | SOLAR-.P$1 0.81,1.26 RF-2.P$1 | C24.P$1 16.65,29.82
  Top 0.6: C1.P$1 5.49,16.26
  Bottom 0.15: U3.27 7.4,28.4 7,28 arc19 6.7,27.58 arc29 v6.59,27.06
  Bottom 0.25: U3.15 11.8,23.55 11.26,23.55 v10.74,23.55
  Bottom 0.4: 2.4,26.87 C4.P$1
  Bottom 0.5: ME6211-1.8V.2 2.4,26.87
  other vias: 13.69,10.59 14.53,10.59 13.69,12.26 15.34,12.26 14.53,12.26 13.69,11.46 15.34,11.46 14.53,11.46 12.15,6.7 12.15,5.9 12.15,5.1 12.15,4.3 12.15,3.5 12.15,2.7 16.15,7.5 16.15,6.7 16.15,5.9 16.15,5.1 16.15,4.3 17,3.9 17,4.7 17,5.5 17,6.3 11.3,3.1 11.3,3.9 11.3,4.7 11.3,5.5 11.3,6.3 10.45,2.7 9.6,2.7 8.75,2.7 7.9,2.7 10.3,7.1 10.3,7.9 12.38,8.64 10.3,8.7 2.5,10.3 2.5,9.5 2.5,8.7 3.5,10.3 3.5,9.5 3.5,8.7 4.5,8.7 4.5,9.5 4.5,10.3 7.05,2.7 6.5,1.9 6.5,1.1 3.77,21.5 9.64,10.21 1.35,25.47 2.15,31.2 1.11,37.64 0.65,33.94 6.73,32.39 3.65,34.14 7.55,35.63 2.58,41.46 4.67,46.31 3.67,46.31 2.67,46.31 2.67,43.5 3.67,43.5 4.67,43.5 1.67,43.15 0.67,43.15 7.67,46.2 8.67,46.2 9.67,46.2 10.67,46.2 11.67,46.2 12.67,46.2 13.67,46.2 17.2,46.2 7.67,42.2 7.67,43.2 7.67,44.2 7.67,45.2 8.67,42.2 9.67,42.2 10.67,42.2 11.67,42.2 12.67,42.2 13.67,42.2 8.67,44.2 9.67,44.2 10.67,44.2 11.67,44.2 12.67,44.2 13.67,44.2 13.67,45.2 13.67,43.2 3.58,41.46 4.58,41.46 2.11,37.64 16.73,13.17 15.58,15.5 8.51,20.2 11.52,19.19 11.73,35.66 10.03,36.93 16.44,33.27 13.64,34.26 14.18,36.93 12.8,36.93 7.67,36.93 13.21,30.84 7.67,41.2 7.67,40.2 7.67,39.2 7.67,38.2 8.67,40.2 9.67,40.2 10.67,40.2 8.67,38.2 11.67,38.2 13.67,40.2 4.58,38.46 0.77,19.36 2.85,19.36 11.52,21.19 8.76,26.25 5.24,23.34 4.48,26.09 17.37,29.2 19.91,33.12 22.17,30.47 22.5,37.5 22.5,34.5 22.6,28.4 19.91,30.47 17.37,27.8 19.91,29.47 16.67,21.11 16.96,24.78 15.65,27.44 16.95,26.75 15.66,25.11 15.66,24.14 14.54,22.11 11.17,15.03 9.5,15.94 8.73,16.67 6.5,20.5 6.5,19.5 13.67,17.63 7.66,15.18 10.98,12.74 22.6,27.51 25.47,28.33 28.13,24.46 8.07,30.82 18.38,33.35 18.38,29.5
  pour Top (rank 2, no thermals): 0,0 18,0 18,23 21,23 21,12 22,11 28,11 29,12 29,38 28,39 22,39 21,38 21,34 18,34 18,47 2.5,47 2.5,43.5 0,43.5
  pour Bottom (no thermals): 0,0 18,0 18,23 21,23 21,12 22,11 28,11 29,12 29,38 28,39 22,39 21,38 21,34 18,34 18,47 2.5,47 2.5,43.5 0,43.5
  pour Bottom: 2.5,29.3 4,29.3 4,29.5 2.5,29.5
GPIO1
  Top 0.15: U$1.P10 15.87,13.05 15.87,14.41 13.06,17.22 13.06,21.39 14.27,22.59 14.27,23.74 14.61,24.08 U4.33
HREF  (via drill 0.3)
  Top 0.15: U4.19 6.25,22.96 6.46,23.16 6.46,23.92 7.15,24.6 7.15,25.14 6.94,25.34 6.94,25.74 7.26,26.06 7.78,26.06 v8.02,26.25
  Bottom 0.15: v8.02,26.25 7.78,26.47 7.78,27.27 8.61,28.08 9.44,28.08 9.8,28.45 U3.21
LEDB
  Top 0.25: U4.48 15.49,31.65 16.29,32.45 16.29,32.55 15.87,32.96 15.87,33.37 15.66,33.58 15.4,33.58 U$4.ANODE
LEDG
  Top 0.25: 12.76,35.26 U$3.ANODE
  Top 0.3: U4.49 12.76,35.26
MISO  (via drill 0.3)
  Top 0.15: U$1.P13 14.53,13.88 14.49,13.91 14.49,14.3 11.87,16.93 v11.15,16.93 | v10.71,18.44 10.25,18.89 10.25,21.45 10.26,21.45 U4.27
  Bottom 0.15: v11.15,16.93 11.07,16.93 10.83,17.17 10.4,17.17 10.24,17.34 9.92,17.34 9.6,17.65 9.6,18.09 9.91,18.39 10.63,18.39 v10.71,18.44
MOSI  (via drill 0.3)
  Top 0.15: U$1.P14 14.03,14.33 12.12,16.23 11.06,16.23 v10.99,16.16 | v9.28,18.5 8.77,18.5 7.53,19.75 7.53,21.35 7.75,21.57 U4.22
  Bottom 0.15: v10.99,16.16 10.94,16.16 10.1,17 9.83,17 9.28,17.55 9.28,18.21 v9.28,18.5
N$1
  Top 0.3: C0.P$1
  Top 0.5: C0.P$1 L0.P$2
N$2
  Top 0.25: U$1.P4 15.03,8.59 C0.P$2
  Top 0.3: LC.P$2 15.94,8.59
  Top 0.5: 15.94,8.59 C0.P$2
N$3
  Top 0.25: U$3.CATHODE 14.62,35.12
  Top 0.5: 14.62,35.12 R12.P$1
N$4
  Top 0.2: U$1.P2 14.02,9.15 13.41,8.55
  Top 0.25: 13.41,8.55 LR1.P$2 | 13.28,7.76 LR2.P$2 13.21,7.74
  Top 0.45: LR1.P$2 13.28,7.76
  Top 0.5: 13.21,7.74 CR1.P$1
N$5
  Top 0.2: 14.53,9.1 14.48,9.01 LR1.P$1
  Top 0.25: U$1.P3 14.53,9.1 | 14.28,7.74 CR2.P$2
  Top 0.45: LR1.P$1 14.28,7.74
N$6
  Top 0.25: 15.14,5.51 LM.P$2 | LR2.P$1 13.21,6.74 | CR2.P$1 14.2,6.49
  Top 0.3: L0.P$1 15.14,5.85
  Top 0.5: 15.14,5.85 LM.P$2 | CM.P$2 15.14,5.51 | 13.21,6.74 CR2.P$1 | 14.2,6.49 14.68,6.11 L0.P$1
N$7
  Top 0.25: 14.92,3.91 arc90 LM.P$1
  Top 0.3: LM.P$1
  Top 0.5: LM.P$1 LM2.P$2 | CM2.P$2 14.92,3.91
N$8
  Top 0.25: LM2.P$1 15.13,2.38
  Top 0.5: CM3.P$2 15.49,2.37 LM2.P$1 | 15.13,2.38 R2.P$2
N$9
  Top 0.25: U$1.P17 11.76,11.93 arc90 TCXO.3
N$10
  pour Top (no thermals): 4.3,16.6 1.1,16.6 1.1,15.2 2.8,15.2 3.3,16.45 4.3,16.45
N$11
  pour Top (no thermals): 5.9,3.6 5.9,5.55 4.3,5.55 4.3,6.55 3.65,6.55 3.65,7 3.35,7 3.35,3.6
N$12
  Top 0.25: 13.23,1 13,1 13,1.13 RF+.P$1
  Top 0.5: R2.P$1 13.23,1
N$13
  Top 0.4: U1.2 4.8,12.31 LDO.P$2
N$14
  Top 0.15: 2.85,12.54 R5.P$2
  Top 0.4: U1.5 2.85,12.54
N$15
  Top 0.15: U1.12 5.46,7.45 | AUX.P$2
  Top 0.4: 5.46,7.45 5.92,7.91 AUX.P$2
N$16
  pour Top (no thermals): 4.3,17.45 4.3,17.6 3.3,17.6 2.8,18.5 1.1,18.5 1.1,17.45
N$17
  Top 0.15: 6.4,11.84 R3.P$1 6.13,11.61
  Top 0.4: R4.P$2 6.4,11.84 | U1.1 6.13,11.61
N$18
  Top 0.4: 1.08,44.92 1,45 1,45.33 RF_IN+.P$1
  Top 0.8: U$2.11_RF_IN 4.6,44.93 4.59,44.92
  Top 1: 1.66,44.93 1.09,44.93 1.08,44.92
  Top 1.6: 4.59,44.92 1.68,44.91 1.66,44.93
N$19
  Top 0.15: R11.P$2 23.62,33.3 23.88,33.05 24.17,33.05 24.67,33.05 U$10.D+
N$20
  Top 0.15: R10.P$2 23.15,32.29 U$10.D-
N$21
  Bottom 0.25: U3.23 9,29.98 C9.P$2 | 10.01,30.16 R6.P$2
  Bottom 0.45: C9.P$2 10.01,30.16
N$25
  Top 0.25: U$4.CATHODE 16.34,34.26
  Top 0.5: 16.34,34.26 R13.P$1
NPCS0  (via drill 0.3)
  Top 0.15: U$1.P15 13.53,14.4 12.24,15.69 v11.66,15.69 11.6,15.63 | v10.76,19.19 10.54,19.41 10.54,21.37 10.75,21.58 10.75,21.7 10.76,21.7 U4.28
  Bottom 0.15: v11.66,15.69 11.61,15.63 10.75,15.63 10.46,15.91 10.46,16.19 9.97,16.69 9.7,16.69 8.99,17.4 8.99,18.02 8.77,18.24 8.77,18.25 8.76,18.25 8.76,18.71 9.08,19.03 9.49,19.03 9.83,18.69 10.21,18.69 v10.76,19.19
NRST  (via drill 0.3)
  Top 0.15: U4.39 15.18,27.15 15.48,26.85 15.53,26.8 v15.65,26.7 | v17.47,26.23 17.48,26.58 17.91,27 18.99,27 | 18.99,27 19,27.01 | 18.99,27 20.11,27 20.61,26.5 20.61,25.3 21.43,24.48 22.57,24.48 22.8,24.25 22.8,22.5 23.43,21.86 23.44,21.86 23.47,21.83 23.82,21.83 24,21.64 JP3.2
  Bottom 0.15: v15.65,26.7 15.76,26.7 16.26,26.7 16.73,26.24 17.46,26.24 v17.47,26.23
PA1  (via drill 0.3)
  Top 0.15: U4.47 13.86,31.15 v13.52,31.52 | R16.P$2 R17.P$2 19.04,31.31 18.73,31 17.69,31 17.52,30.83 17.52,30.52 v17.37,30.37
  Bottom 0.15: v17.37,30.37 17.2,30.37 16.94,30.62 16.65,30.62 16.13,31.14 16.13,31.44 15.84,31.73 13.73,31.73 v13.52,31.52
PCLK  (via drill 0.3)
  Top 0.15: v6.25,25.87 5.09,25.87 4.28,25.05 4.28,24.8 4.13,24.66 U4.15
  Bottom 0.15: U3.26 7.8,28.12 7.17,27.49 7.17,26.79 v6.25,25.87
SDN  (via drill 0.3)
  Top 0.15: U$1.P1 13.36,9.29 v11.54,9.29 R1.P$1 | v15.33,14.19 15.33,14.35 12.75,16.93 12.75,21.52 12.76,21.52 U4.32
  Bottom 0.15: v11.54,9.29 v11.53,9.3 11.53,9.59 11.97,10.03 12.83,10.03 13.01,10.21 13.01,12.7 13.2,12.89 15.11,12.89 15.33,13.11 v15.33,14.19
SOLAR+  (via drill 0.3)
  Bottom 0.15: v0.66,7
  Bottom 0.3: R9.P$1 v0.66,7
  pour Top (no thermals): 0.4,7.9 1.6,7.9 1.6,6.9 1.8,6.55 2.7,6.55 2.7,7 3,7 3,3.6 1.6,3.6 1.6,5 0.4,5
SPCK  (via drill 0.3)
  Top 0.15: U$1.P12 15.03,13.74 14.79,13.97 14.79,14.45 v11.78,17.46 | v10.13,17.86 8.99,17.86 7.24,19.61 7.24,22.29 U4.21
  Bottom 0.15: v11.78,17.46 10.54,17.46 v10.13,17.86
TCXOEN
  Top 0.3: TCXO.4 10.4,14.84 CD5.P$2 10.4,17.14 12.26,19 U4.31
TWCK0  (via drill 0.3)
  Top 0.15: v6.28,28.08 6.75,28.85 13.12,28.85 13.26,28.71 13.26,28.39 13.18,28.31 13.18,27.67 v12.99,27.48 | U4.36 15.35,25.65 v15.67,25.95 | v20,26 20.32,25.68 20.32,25.16 21.29,24.18 22.34,24.18 22.51,24.02 22.51,22.35 22.84,22.02 22.84,19.97 23.5,19.31 24.82,19.31 | 24.82,19.31 24.83,19.32 | 24.82,19.31 25.79,19.31 26.08,19.02 26.08,18.38 JP6.2
  Bottom 0.15: U3.28 7,28.52 6.81,28.33 6.54,28.33 v6.28,28.08 | v12.99,27.48 12.99,27.42 12.99,26.52 13.63,25.88 13.63,25.75 13.73,25.65 14.81,25.65 | R7.P$1 14.81,25.3 14.81,25.65 | 14.81,25.65 15.35,25.65 v15.67,25.95 17,25.95 17.27,25.68 17.64,25.68 17.94,25.98 17.97,26 18.66,26 18.76,25.91 19.91,25.91 v20,26 19.98,25.98
TWD0  (via drill 0.3)
  Top 0.15: v5.64,29.64 5.99,29.29 6.06,29.21 6.13,29.15 U4.43 15.31,29.15 15.64,28.82 15.64,28.21 v15.65,28.19 | v19.24,26.5 19.47,26.34 19.47,25.77 20.03,25.21 20.03,25.03 21.18,23.88 22.08,23.88 22.22,23.74 22.22,22.21 22.55,21.88 22.55,19.84 23.38,19.02 23.9,19.02 24,18.93 JP6.1
  Bottom 0.15: U3.29 6.6,29.64 6.42,29.81 5.82,29.81 v5.64,29.64 | R8.P$1 v15.65,28.19 16.25,28.19 17.44,27 19,27 19.24,26.76 v19.24,26.5
URXD0  (via drill 0.3)
  Top 0.15: U4.30 11.76,23.03 11.98,23.26 v13.6,23.26 | v21.64,21.48 21.98,21.15 21.98,19.57 22.51,19.04 22.51,17.34 23.4,16.45 23.9,16.45 24,16.34 JP5.1
  Bottom 0.15: v13.6,23.26 14.46,23.26 14.47,23.25 17.29,23.25 17.61,23.57 17.61,24.81 17.8,25 18.94,25 18.94,24.98 19.24,24.98 20.88,23.34 21.16,23.34 21.39,23.11 21.39,21.73 v21.64,21.48
URXD1  (via drill 0.3)
  Top 0.15: U$2.2_TXD1 13.35,38.32 11.03,36 11.03,35.23 v11.69,34.58 | v7.05,31.55 6.37,30.87 4.57,30.87 4.29,30.6 4.29,29.84 4.13,29.67 3.43,29.67 U4.5
  Bottom 0.15: v11.69,34.58 11.66,34.58 11.11,34.02 10.62,34.02 10.52,34.13 8.47,34.13 7.26,32.92 7.26,32.09 7.05,31.87 v7.05,31.55
UTXD0  (via drill 0.3)
  Top 0.15: U4.29 11.26,22.97 12.27,24 13.5,24 v13.51,24 | v17.07,24.03 17.45,24.03 17.61,24.19 17.61,24.8 17.81,25 18.77,25 | 18.77,25 18.77,25.01 | 18.77,25 19.65,25 21.07,23.58 21.79,23.58 21.94,23.43 21.94,22.08 22.27,21.75 22.27,19.71 22.8,19.17 22.8,17.47 23.48,16.8 23.48,16.79 23.5,16.77 25.75,16.77 26.09,16.42 26.09,15.83 JP5.2
  Bottom 0.15: v13.51,24 13.64,24 14.06,23.56 14.46,23.56 | 14.46,23.56 | 14.46,23.56 16.9,23.56 17.06,23.73 17.06,23.79 17.06,23.99 v17.07,24.03
UTXD1  (via drill 0.3)
  Top 0.15: U$2.3_RXD1 15.1,39.42 14.29,38.61 13.22,38.61 11.55,36.93 v11.01,36.93 | v7.8,31.55 7.8,31.52 7.28,31.02 6.94,31.02 6.5,30.57 4.71,30.57 4.59,30.45 4.59,29.69 4.24,29.34 4.24,29.26 4.13,29.15 U4.6
  Bottom 0.15: v11.01,36.93 11.03,36.91 11.03,35.53 11.47,35.09 11.92,35.09 12.25,34.76 12.25,34.36 11.93,34.05 11.59,34.05 11.27,33.72 10.48,33.72 10.37,33.84 8.62,33.84 7.57,32.78 7.57,31.77 v7.8,31.55
VBUS
  Top 0.15: R16.P$1
  Top 0.4: U$10.VBUS 23.94,31.64 23.6,31.31 R16.P$1 | 23.47,30.8 23.47,30.91 | 23.97,28.22 U$9.3
  Top 0.5: 23.47,30.91 R16.P$1
  Top 0.6: U$9.3 23.47,28.72 23.47,30.8 | 23.97,28.22 C26.P$2 23.97,26.66 24.45,26.19 JP7.1
VSYNC  (via drill 0.3)
  Top 0.15: U4.20 6.75,23.77 7.18,24.2 7.37,24.2 7.44,24.27 7.44,25.48 v7.5,25.55
  Bottom 0.15: v7.5,25.55 7.5,25.59 7.5,26.02 7.5,27.4 8.47,28.36 9.27,28.36 9.4,28.5 U3.22
XIN
  Top 0.15: CFPX-104.1 3.41,35.98 4.42,34.96 4.86,34.96 5.51,34.31 6.17,34.31 6.26,34.22 U4.62 | C12.P$2 2.3,35
  Top 0.4: 2.3,35 CFPX-104.1
XOUT
  Top 0.15: U4.61 6.75,34.29 6.73,34.31 6.59,34.31 6.3,34.6 5.65,34.6 5,35.26 4.55,35.26 4.31,35.5 4.31,37.02 4.17,37.16 3.64,37.16 1.11,39.69 CFPX-104.3 0.65,40.37
  Top 0.4: C10.P$2 0.65,40.37

### Text on the board
tPlace: 5V | ERA | 3.3 | RES | GND | SDA | SCK | RX | TX | 3.3 | GND
bPlace: bat+ | TT7F | tracker v1.4 | bat- | sol+ | sol-
tDocu: 100nF | UBLOX MAX-7C | 15pF | CFPX104 16MHz | 100R | 2.2uF | 100nF | 100R | 15pF | 100nF | 100nF | 27R | USB Micro B | OSG50603C1E | 27R | OSB50603C1E | 100nF | 91k | 75k | 10uF | 2.2uF | 2.2uF | SAM3S8B | MCP1700T3302E | 100nF | 100nF | 1uF | 1uF | 10uF | 100nF | 100nF | 2.2uF | 100nF | 10uF | ME6211-2.8V | DLJ3015-2.2uH | TPS63031 | 100nF | 10nF | 2.2uF | 4.7uF | I547-2P3-32MHz | 100nF | SI4060 | 100pF | 91k | 4.7uF | 1.5M | 470k | 15pF | LTC3105 | 1uF | 91k | 10uF | 220nH | 15pF | 56nH | 10uF | 8.2pF | 15pF | 18nH | 18nH | 8.2pF | DLJ4018-10uH | 0R
bDocu: 100nF | 100nF | 10k | ME6211-1.8V | 1.5k | MT9D111 | 100nF | 1.5k | 1M | 1M | 0R